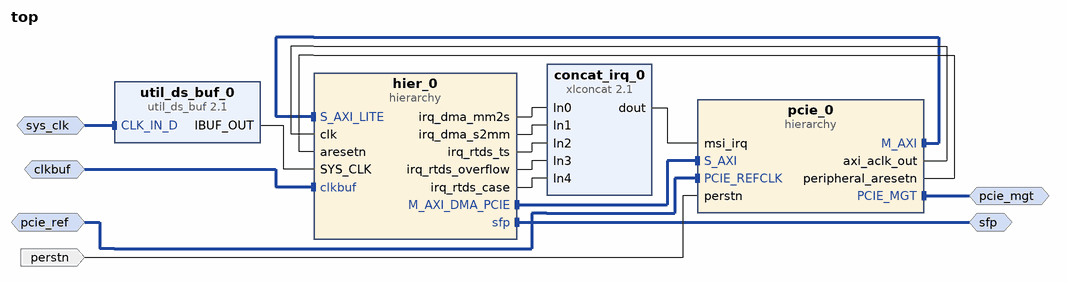
[diagram p0: block diagram of the top level]
# Vivado block design top, Vivado 2016.1
create_bd_design top

create_bd_intf_port -mode Slave -vlnv xilinx.com:interface:diff_clock_rtl:1.0 pcie_ref
create_bd_intf_port -mode Master -vlnv xilinx.com:interface:sfp_rtl:1.0 sfp
create_bd_intf_port -mode Slave -vlnv xilinx.com:interface:diff_clock_rtl:1.0 clkbuf
create_bd_intf_port -mode Slave -vlnv xilinx.com:interface:diff_clock_rtl:1.0 sys_clk
set_property -dict {CONFIG.FREQ_HZ 200000000} [get_bd_intf_ports sys_clk]
create_bd_intf_port -mode Master -vlnv xilinx.com:interface:pcie_7x_mgt_rtl:1.0 pcie_mgt
create_bd_port -dir I -type rst perstn

create_bd_cell -type hier hier_0
create_bd_cell -type ip -vlnv xilinx.com:ip:xlconcat:2.1 concat_irq_0
set_property -dict {CONFIG.NUM_PORTS 5} [get_bd_cells concat_irq_0]
create_bd_cell -type hier pcie_0
create_bd_cell -type ip -vlnv xilinx.com:ip:util_ds_buf:2.1 util_ds_buf_0
set_property -dict {CONFIG.USE_BOARD_FLOW true CONFIG.DIFF_CLK_IN_BOARD_INTERFACE sys_diff_clock} [get_bd_cells util_ds_buf_0]

# ---- hierarchy /hier_0 ----
current_bd_instance /hier_0
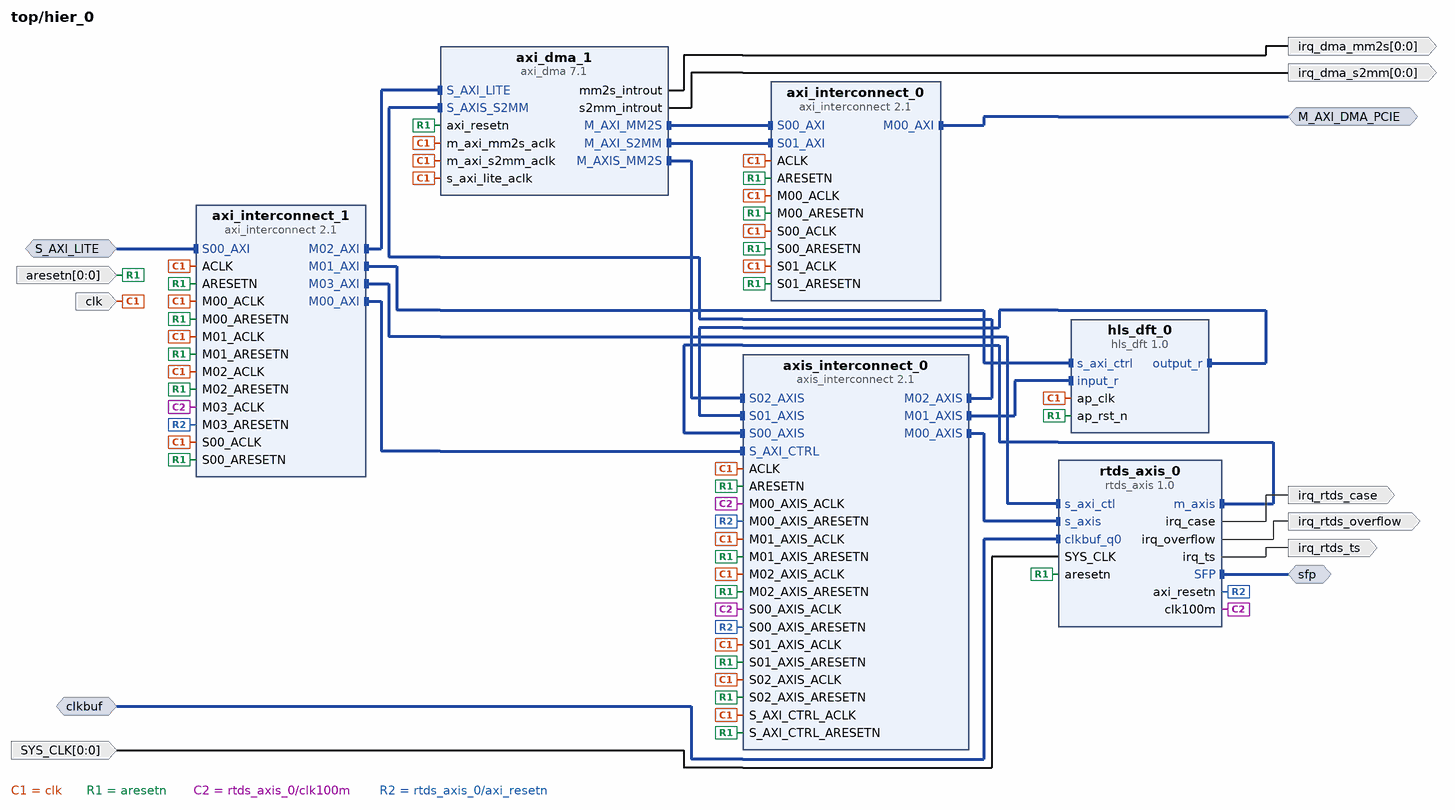
[diagram p1: block diagram inside /hier_0]
create_bd_intf_pin -mode Slave -vlnv xilinx.com:interface:aximm_rtl:1.0 S_AXI_LITE
create_bd_intf_pin -mode Master -vlnv xilinx.com:interface:sfp_rtl:1.0 sfp
create_bd_intf_pin -mode Slave -vlnv xilinx.com:interface:diff_clock_rtl:1.0 clkbuf
create_bd_intf_pin -mode Master -vlnv xilinx.com:interface:aximm_rtl:1.0 M_AXI_DMA_PCIE
create_bd_pin -dir I -type clk clk
create_bd_pin -dir I -from 0 -to 0 -type rst aresetn
create_bd_pin -dir O -from 0 -to 0 -type intr irq_dma_mm2s
create_bd_pin -dir O -from 0 -to 0 -type intr irq_dma_s2mm
create_bd_pin -dir I -from 0 -to 0 -type clk SYS_CLK
create_bd_pin -dir O irq_rtds_ts
create_bd_pin -dir O irq_rtds_overflow
create_bd_pin -dir O irq_rtds_case

create_bd_cell -type ip -vlnv xilinx.com:ip:axi_dma:7.1 axi_dma_1
set_property -dict [list \
  CONFIG.c_include_sg 0 \
  CONFIG.c_m_axi_mm2s_data_width 128 \
  CONFIG.c_include_mm2s_dre 1 \
  CONFIG.c_mm2s_burst_size 64 \
  CONFIG.c_m_axi_s2mm_data_width 128 \
  CONFIG.c_include_s2mm_dre 1 \
  CONFIG.c_s2mm_burst_size 64 \
] [get_bd_cells axi_dma_1]
create_bd_cell -type ip -vlnv xilinx.com:ip:axi_interconnect:2.1 axi_interconnect_0
set_property -dict {CONFIG.NUM_SI 2 CONFIG.NUM_MI 1} [get_bd_cells axi_interconnect_0]
create_bd_cell -type ip -vlnv xilinx.com:ip:axis_interconnect:2.1 axis_interconnect_0
set_property -dict [list \
  CONFIG.NUM_SI 3 \
  CONFIG.NUM_MI 3 \
  CONFIG.ENABLE_ADVANCED_OPTIONS 1 \
  CONFIG.ROUTING_MODE 1 \
] [get_bd_cells axis_interconnect_0]
create_bd_cell -type ip -vlnv xilinx.com:ip:axi_interconnect:2.1 axi_interconnect_1
set_property -dict {CONFIG.NUM_MI 4} [get_bd_cells axi_interconnect_1]
create_bd_cell -type ip -vlnv acs.eonerc.rwth-aachen.de:hls:hls_dft:1.0 hls_dft_0
create_bd_cell -type ip -vlnv acs.eonerc.rwth-aachen.de:user:rtds_axis:1.0 rtds_axis_0

# ---- hierarchy /pcie_0 ----
current_bd_instance /pcie_0
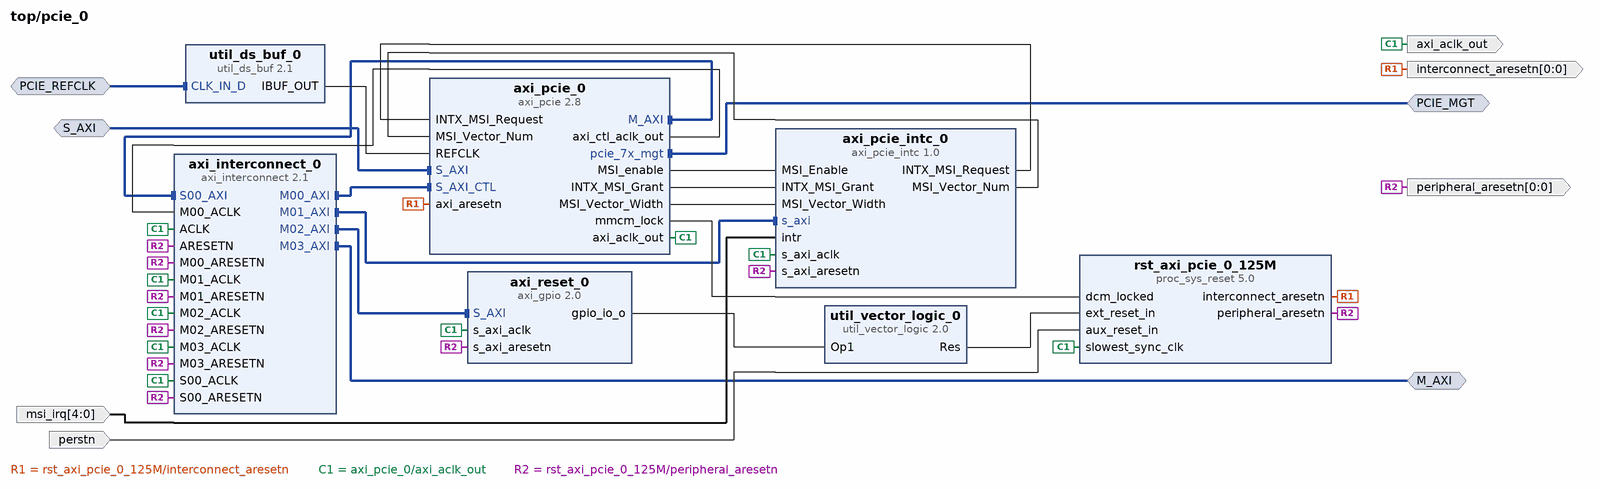
[diagram p2: block diagram inside /pcie_0]
create_bd_intf_pin -mode Master -vlnv xilinx.com:interface:aximm_rtl:1.0 M_AXI
create_bd_intf_pin -mode Master -vlnv xilinx.com:interface:pcie_7x_mgt_rtl:1.0 PCIE_MGT
create_bd_intf_pin -mode Slave -vlnv xilinx.com:interface:diff_clock_rtl:1.0 PCIE_REFCLK
create_bd_intf_pin -mode Slave -vlnv xilinx.com:interface:aximm_rtl:1.0 S_AXI
create_bd_pin -dir O -type clk axi_aclk_out
create_bd_pin -dir O -from 0 -to 0 -type rst interconnect_aresetn
create_bd_pin -dir I -from 4 -to 0 msi_irq
create_bd_pin -dir O -from 0 -to 0 -type rst peripheral_aresetn
create_bd_pin -dir I -type rst perstn

create_bd_cell -type ip -vlnv xilinx.com:ip:axi_gpio:2.0 axi_reset_0
set_property -dict [list \
  CONFIG.C_GPIO_WIDTH 1 \
  CONFIG.C_DOUT_DEFAULT 0x00000000 \
  CONFIG.C_INTERRUPT_PRESENT 0 \
  CONFIG.C_ALL_OUTPUTS 1 \
] [get_bd_cells axi_reset_0]
create_bd_cell -type ip -vlnv xilinx.com:ip:axi_interconnect:2.1 axi_interconnect_0
set_property -dict {CONFIG.NUM_MI 4} [get_bd_cells axi_interconnect_0]
create_bd_cell -type ip -vlnv xilinx.com:ip:axi_pcie:2.8 axi_pcie_0
set_property -dict [list \
  CONFIG.NO_OF_LANES X4 \
  CONFIG.MAX_LINK_SPEED 5.0_GT/s \
  CONFIG.DEVICE_ID 0x7022 \
  CONFIG.ENABLE_CLASS_CODE false \
  CONFIG.CLASS_CODE 0x050000 \
  CONFIG.BASE_CLASS_MENU Memory_controller \
  CONFIG.SUB_CLASS_INTERFACE_MENU RAM \
  CONFIG.BAR1_ENABLED false \
  CONFIG.BAR1_TYPE N/A \
  CONFIG.BAR0_SCALE Kilobytes \
  CONFIG.BAR1_SCALE N/A \
  CONFIG.BAR0_SIZE 64 \
  CONFIG.BAR1_SIZE 8 \
  CONFIG.PCIEBAR2AXIBAR_1 0xFFFFFFFF \
  CONFIG.INTERRUPT_PIN false \
  CONFIG.NUM_MSI_REQ 4 \
  CONFIG.COMP_TIMEOUT 50ms \
  CONFIG.AXIBAR_AS_0 false \
  CONFIG.AXIBAR2PCIEBAR_0 0x00000000 \
  CONFIG.S_AXI_DATA_WIDTH 128 \
  CONFIG.M_AXI_DATA_WIDTH 128 \
  CONFIG.S_AXI_SUPPORTS_NARROW_BURST true \
  CONFIG.XLNX_REF_BOARD VC707 \
  CONFIG.PCIE_BLK_LOCN X1Y0 \
  CONFIG.AXIBAR_NUM 1 \
  CONFIG.en_transceiver_status_ports false \
] [get_bd_cells axi_pcie_0]
create_bd_cell -type ip -vlnv xilinx.com:ip:proc_sys_reset:5.0 rst_axi_pcie_0_125M
set_property -dict [list \
  CONFIG.C_AUX_RESET_HIGH 0 \
  CONFIG.C_AUX_RST_WIDTH 1 \
  CONFIG.C_EXT_RST_WIDTH 8 \
  CONFIG.USE_BOARD_FLOW true \
  CONFIG.RESET_BOARD_INTERFACE Custom \
] [get_bd_cells rst_axi_pcie_0_125M]
create_bd_cell -type ip -vlnv xilinx.com:ip:util_ds_buf:2.1 util_ds_buf_0
set_property -dict {CONFIG.C_BUF_TYPE IBUFDSGTE} [get_bd_cells util_ds_buf_0]
create_bd_cell -type ip -vlnv xilinx.com:ip:util_vector_logic:2.0 util_vector_logic_0
set_property -dict {CONFIG.C_SIZE 1 CONFIG.C_OPERATION not} [get_bd_cells util_vector_logic_0]
create_bd_cell -type ip -vlnv acs.eonerc.rwth-aachen.de:user:axi_pcie_intc:1.0 axi_pcie_intc_0

# ---- connections ----

current_bd_instance /hier_0
connect_bd_intf_net [get_bd_intf_pins axi_interconnect_0/S00_AXI] [get_bd_intf_pins axi_dma_1/M_AXI_MM2S]
connect_bd_intf_net [get_bd_intf_pins axi_interconnect_0/S01_AXI] [get_bd_intf_pins axi_dma_1/M_AXI_S2MM]
connect_bd_intf_net [get_bd_intf_pins rtds_axis_0/s_axis] [get_bd_intf_pins axis_interconnect_0/M00_AXIS]
connect_bd_intf_net [get_bd_intf_pins rtds_axis_0/m_axis] [get_bd_intf_pins axis_interconnect_0/S00_AXIS]
connect_bd_intf_net -intf_net axi_interconnect_mm_0_M00_AXI [get_bd_intf_pins axi_interconnect_1/M00_AXI] [get_bd_intf_pins axis_interconnect_0/S_AXI_CTRL]
connect_bd_intf_net -intf_net axi_interconnect_mm_0_M02_AXI [get_bd_intf_pins axi_dma_1/S_AXI_LITE] [get_bd_intf_pins axi_interconnect_1/M02_AXI]
connect_bd_intf_net -intf_net axi_interconnect_mm_0_M03_AXI [get_bd_intf_pins axi_interconnect_1/M03_AXI] [get_bd_intf_pins rtds_axis_0/s_axi_ctl]
connect_bd_intf_net [get_bd_intf_pins axi_dma_1/M_AXIS_MM2S] [get_bd_intf_pins axis_interconnect_0/S02_AXIS]
connect_bd_intf_net [get_bd_intf_pins axi_dma_1/S_AXIS_S2MM] [get_bd_intf_pins axis_interconnect_0/M02_AXIS]
connect_bd_intf_net [get_bd_intf_pins hls_dft_0/output_r] [get_bd_intf_pins axis_interconnect_0/S01_AXIS]
connect_bd_intf_net [get_bd_intf_pins hls_dft_0/input_r] [get_bd_intf_pins axis_interconnect_0/M01_AXIS]
connect_bd_intf_net [get_bd_intf_pins axi_interconnect_1/M01_AXI] [get_bd_intf_pins hls_dft_0/s_axi_ctrl]
connect_bd_intf_net [get_bd_intf_pins S_AXI_LITE] [get_bd_intf_pins axi_interconnect_1/S00_AXI]
connect_bd_intf_net [get_bd_intf_pins sfp] [get_bd_intf_pins rtds_axis_0/SFP]
connect_bd_intf_net [get_bd_intf_pins clkbuf] [get_bd_intf_pins rtds_axis_0/clkbuf_q0]
connect_bd_intf_net [get_bd_intf_pins M_AXI_DMA_PCIE] [get_bd_intf_pins axi_interconnect_0/M00_AXI]
connect_bd_net -net s_axi_aclk_1 [get_bd_pins clk] \
  [get_bd_pins axi_dma_1/s_axi_lite_aclk] [get_bd_pins axi_dma_1/m_axi_mm2s_aclk] [get_bd_pins axi_dma_1/m_axi_s2mm_aclk] \
  [get_bd_pins hls_dft_0/ap_clk] [get_bd_pins axi_interconnect_0/ACLK] [get_bd_pins axi_interconnect_0/S00_ACLK] \
  [get_bd_pins axi_interconnect_0/M00_ACLK] [get_bd_pins axi_interconnect_0/S01_ACLK] [get_bd_pins axi_interconnect_1/ACLK] \
  [get_bd_pins axi_interconnect_1/S00_ACLK] [get_bd_pins axi_interconnect_1/M00_ACLK] \
  [get_bd_pins axi_interconnect_1/M01_ACLK] [get_bd_pins axi_interconnect_1/M02_ACLK] [get_bd_pins axis_interconnect_0/ACLK] \
  [get_bd_pins axis_interconnect_0/M01_AXIS_ACLK] [get_bd_pins axis_interconnect_0/S01_AXIS_ACLK] \
  [get_bd_pins axis_interconnect_0/S_AXI_CTRL_ACLK] [get_bd_pins axis_interconnect_0/S02_AXIS_ACLK] \
  [get_bd_pins axis_interconnect_0/M02_AXIS_ACLK]
connect_bd_net -net pcie_0_peripheral_aresetn [get_bd_pins aresetn] \
  [get_bd_pins axi_dma_1/axi_resetn] [get_bd_pins hls_dft_0/ap_rst_n] [get_bd_pins rtds_axis_0/aresetn] \
  [get_bd_pins axi_interconnect_0/ARESETN] [get_bd_pins axi_interconnect_0/S01_ARESETN] \
  [get_bd_pins axi_interconnect_0/S00_ARESETN] [get_bd_pins axi_interconnect_0/M00_ARESETN] \
  [get_bd_pins axi_interconnect_1/ARESETN] [get_bd_pins axi_interconnect_1/S00_ARESETN] \
  [get_bd_pins axi_interconnect_1/M00_ARESETN] [get_bd_pins axi_interconnect_1/M01_ARESETN] \
  [get_bd_pins axi_interconnect_1/M02_ARESETN] [get_bd_pins axis_interconnect_0/M02_AXIS_ARESETN] \
  [get_bd_pins axis_interconnect_0/S02_AXIS_ARESETN] [get_bd_pins axis_interconnect_0/S_AXI_CTRL_ARESETN] \
  [get_bd_pins axis_interconnect_0/S01_AXIS_ARESETN] [get_bd_pins axis_interconnect_0/M01_AXIS_ARESETN] \
  [get_bd_pins axis_interconnect_0/ARESETN]
connect_bd_net [get_bd_pins SYS_CLK] [get_bd_pins rtds_axis_0/SYS_CLK]
connect_bd_net [get_bd_pins rtds_axis_0/irq_ts] [get_bd_pins irq_rtds_ts]
connect_bd_net [get_bd_pins rtds_axis_0/irq_overflow] [get_bd_pins irq_rtds_overflow]
connect_bd_net [get_bd_pins rtds_axis_0/irq_case] [get_bd_pins irq_rtds_case]
connect_bd_net [get_bd_pins rtds_axis_0/clk100m] \
  [get_bd_pins axi_interconnect_1/M03_ACLK] [get_bd_pins axis_interconnect_0/S00_AXIS_ACLK] \
  [get_bd_pins axis_interconnect_0/M00_AXIS_ACLK]
connect_bd_net [get_bd_pins rtds_axis_0/axi_resetn] \
  [get_bd_pins axis_interconnect_0/S00_AXIS_ARESETN] [get_bd_pins axis_interconnect_0/M00_AXIS_ARESETN] \
  [get_bd_pins axi_interconnect_1/M03_ARESETN]
connect_bd_net [get_bd_pins axi_dma_1/mm2s_introut] [get_bd_pins irq_dma_mm2s]
connect_bd_net [get_bd_pins axi_dma_1/s2mm_introut] [get_bd_pins irq_dma_s2mm]

current_bd_instance /pcie_0
connect_bd_intf_net [get_bd_intf_pins axi_interconnect_0/M00_AXI] [get_bd_intf_pins axi_pcie_0/S_AXI_CTL]
connect_bd_intf_net [get_bd_intf_pins axi_reset_0/S_AXI] [get_bd_intf_pins axi_interconnect_0/M02_AXI]
connect_bd_intf_net [get_bd_intf_pins axi_interconnect_0/M01_AXI] [get_bd_intf_pins axi_pcie_intc_0/s_axi]
connect_bd_intf_net [get_bd_intf_pins axi_pcie_0/M_AXI] [get_bd_intf_pins axi_interconnect_0/S00_AXI]
connect_bd_intf_net [get_bd_intf_pins M_AXI] [get_bd_intf_pins axi_interconnect_0/M03_AXI]
connect_bd_intf_net [get_bd_intf_pins PCIE_MGT] [get_bd_intf_pins axi_pcie_0/pcie_7x_mgt]
connect_bd_intf_net -intf_net pcie_ref_1 [get_bd_intf_pins PCIE_REFCLK] [get_bd_intf_pins util_ds_buf_0/CLK_IN_D]
connect_bd_intf_net [get_bd_intf_pins S_AXI] [get_bd_intf_pins axi_pcie_0/S_AXI]
connect_bd_net -net S00_ARESETN_1 [get_bd_pins rst_axi_pcie_0_125M/interconnect_aresetn] \
  [get_bd_pins interconnect_aresetn] [get_bd_pins axi_pcie_0/axi_aresetn]
connect_bd_net -net aux_reset_in_1 [get_bd_pins perstn] [get_bd_pins rst_axi_pcie_0_125M/aux_reset_in]
connect_bd_net [get_bd_pins axi_pcie_0/axi_aclk_out] \
  [get_bd_pins axi_aclk_out] [get_bd_pins axi_reset_0/s_axi_aclk] [get_bd_pins rst_axi_pcie_0_125M/slowest_sync_clk] \
  [get_bd_pins axi_pcie_intc_0/s_axi_aclk] [get_bd_pins axi_interconnect_0/ACLK] [get_bd_pins axi_interconnect_0/S00_ACLK] \
  [get_bd_pins axi_interconnect_0/M01_ACLK] [get_bd_pins axi_interconnect_0/M02_ACLK] \
  [get_bd_pins axi_interconnect_0/M03_ACLK]
connect_bd_net [get_bd_pins axi_pcie_0/axi_ctl_aclk_out] [get_bd_pins axi_interconnect_0/M00_ACLK]
connect_bd_net [get_bd_pins axi_pcie_0/mmcm_lock] [get_bd_pins rst_axi_pcie_0_125M/dcm_locked]
connect_bd_net [get_bd_pins util_ds_buf_0/IBUF_OUT] [get_bd_pins axi_pcie_0/REFCLK]
connect_bd_net [get_bd_pins rst_axi_pcie_0_125M/peripheral_aresetn] \
  [get_bd_pins peripheral_aresetn] [get_bd_pins axi_reset_0/s_axi_aresetn] [get_bd_pins axi_pcie_intc_0/s_axi_aresetn] \
  [get_bd_pins axi_interconnect_0/ARESETN] [get_bd_pins axi_interconnect_0/S00_ARESETN] \
  [get_bd_pins axi_interconnect_0/M01_ARESETN] [get_bd_pins axi_interconnect_0/M02_ARESETN] \
  [get_bd_pins axi_interconnect_0/M00_ARESETN] [get_bd_pins axi_interconnect_0/M03_ARESETN]
connect_bd_net [get_bd_pins axi_pcie_intc_0/INTX_MSI_Request] [get_bd_pins axi_pcie_0/INTX_MSI_Request]
connect_bd_net [get_bd_pins axi_pcie_intc_0/MSI_Vector_Num] [get_bd_pins axi_pcie_0/MSI_Vector_Num]
connect_bd_net [get_bd_pins msi_irq] [get_bd_pins axi_pcie_intc_0/intr]
connect_bd_net [get_bd_pins axi_pcie_0/MSI_enable] [get_bd_pins axi_pcie_intc_0/MSI_Enable]
connect_bd_net [get_bd_pins axi_pcie_0/INTX_MSI_Grant] [get_bd_pins axi_pcie_intc_0/INTX_MSI_Grant]
connect_bd_net [get_bd_pins axi_pcie_0/MSI_Vector_Width] [get_bd_pins axi_pcie_intc_0/MSI_Vector_Width]
connect_bd_net [get_bd_pins axi_reset_0/gpio_io_o] [get_bd_pins util_vector_logic_0/Op1]
connect_bd_net [get_bd_pins util_vector_logic_0/Res] [get_bd_pins rst_axi_pcie_0_125M/ext_reset_in]

current_bd_instance /
connect_bd_intf_net [get_bd_intf_pins hier_0/M_AXI_DMA_PCIE] [get_bd_intf_pins pcie_0/S_AXI]
connect_bd_intf_net [get_bd_intf_pins pcie_0/M_AXI] [get_bd_intf_pins hier_0/S_AXI_LITE]
connect_bd_intf_net [get_bd_intf_ports pcie_ref] [get_bd_intf_pins pcie_0/PCIE_REFCLK]
connect_bd_intf_net [get_bd_intf_ports sfp] [get_bd_intf_pins hier_0/sfp]
connect_bd_intf_net [get_bd_intf_ports clkbuf] [get_bd_intf_pins hier_0/clkbuf]
connect_bd_intf_net -intf_net sys_diff_clock_1 [get_bd_intf_ports sys_clk] [get_bd_intf_pins util_ds_buf_0/CLK_IN_D]
connect_bd_intf_net -intf_net pcie_PCIE_MGT [get_bd_intf_ports pcie_mgt] [get_bd_intf_pins pcie_0/PCIE_MGT]
connect_bd_net -net s_axi_aclk_1 [get_bd_pins pcie_0/axi_aclk_out] [get_bd_pins hier_0/clk]
connect_bd_net [get_bd_pins pcie_0/peripheral_aresetn] [get_bd_pins hier_0/aresetn]
connect_bd_net [get_bd_pins util_ds_buf_0/IBUF_OUT] [get_bd_pins hier_0/SYS_CLK]
connect_bd_net [get_bd_ports perstn] [get_bd_pins pcie_0/perstn]
connect_bd_net -net msi_irq_1 [get_bd_pins concat_irq_0/dout] [get_bd_pins pcie_0/msi_irq]
connect_bd_net [get_bd_pins hier_0/irq_dma_mm2s] [get_bd_pins concat_irq_0/In0]
connect_bd_net [get_bd_pins hier_0/irq_dma_s2mm] [get_bd_pins concat_irq_0/In1]
connect_bd_net -net hier_0_irq_ts [get_bd_pins hier_0/irq_rtds_ts] [get_bd_pins concat_irq_0/In2]
connect_bd_net -net hier_0_irq_overflow [get_bd_pins hier_0/irq_rtds_overflow] [get_bd_pins concat_irq_0/In3]
connect_bd_net -net hier_0_irq_case [get_bd_pins hier_0/irq_rtds_case] [get_bd_pins concat_irq_0/In4]

# ---- address map ----
assign_bd_address -offset 0x80000000 -range 2G -target_address_space [get_bd_addr_spaces hier_0/axi_dma_1/Data_MM2S] [get_bd_addr_segs pcie_0/axi_pcie_0/S_AXI/BAR0]
assign_bd_address -offset 0x80000000 -range 2G -target_address_space [get_bd_addr_spaces hier_0/axi_dma_1/Data_S2MM] [get_bd_addr_segs pcie_0/axi_pcie_0/S_AXI/BAR0]
assign_bd_address -offset 0x00000000 -range 4K -target_address_space [get_bd_addr_spaces pcie_0/axi_pcie_0/M_AXI] [get_bd_addr_segs hier_0/axis_interconnect_0/xbar/S_AXI_CTRL/Reg]
assign_bd_address -offset 0x00001000 -range 4K -target_address_space [get_bd_addr_spaces pcie_0/axi_pcie_0/M_AXI] [get_bd_addr_segs hier_0/axi_dma_1/S_AXI_LITE/Reg]
assign_bd_address -offset 0x00002000 -range 4K -target_address_space [get_bd_addr_spaces pcie_0/axi_pcie_0/M_AXI] [get_bd_addr_segs pcie_0/axi_reset_0/S_AXI/Reg]
assign_bd_address -offset 0x00003000 -range 4K -target_address_space [get_bd_addr_spaces pcie_0/axi_pcie_0/M_AXI] [get_bd_addr_segs hier_0/rtds_axis_0/s_axi_ctl/reg0]
assign_bd_address -offset 0x00004000 -range 4K -target_address_space [get_bd_addr_spaces pcie_0/axi_pcie_0/M_AXI] [get_bd_addr_segs hier_0/hls_dft_0/s_axi_ctrl/Reg]
assign_bd_address -offset 0x00005000 -range 4K -target_address_space [get_bd_addr_spaces pcie_0/axi_pcie_0/M_AXI] [get_bd_addr_segs pcie_0/axi_pcie_intc_0/s_axi/Reg]
assign_bd_address -offset 0x10000000 -range 256M -target_address_space [get_bd_addr_spaces pcie_0/axi_pcie_0/M_AXI] [get_bd_addr_segs pcie_0/axi_pcie_0/S_AXI_CTL/CTL0]

validate_bd_design
save_bd_design
